# EAGLE design MetalDetector (EAGLE 7.2.0)
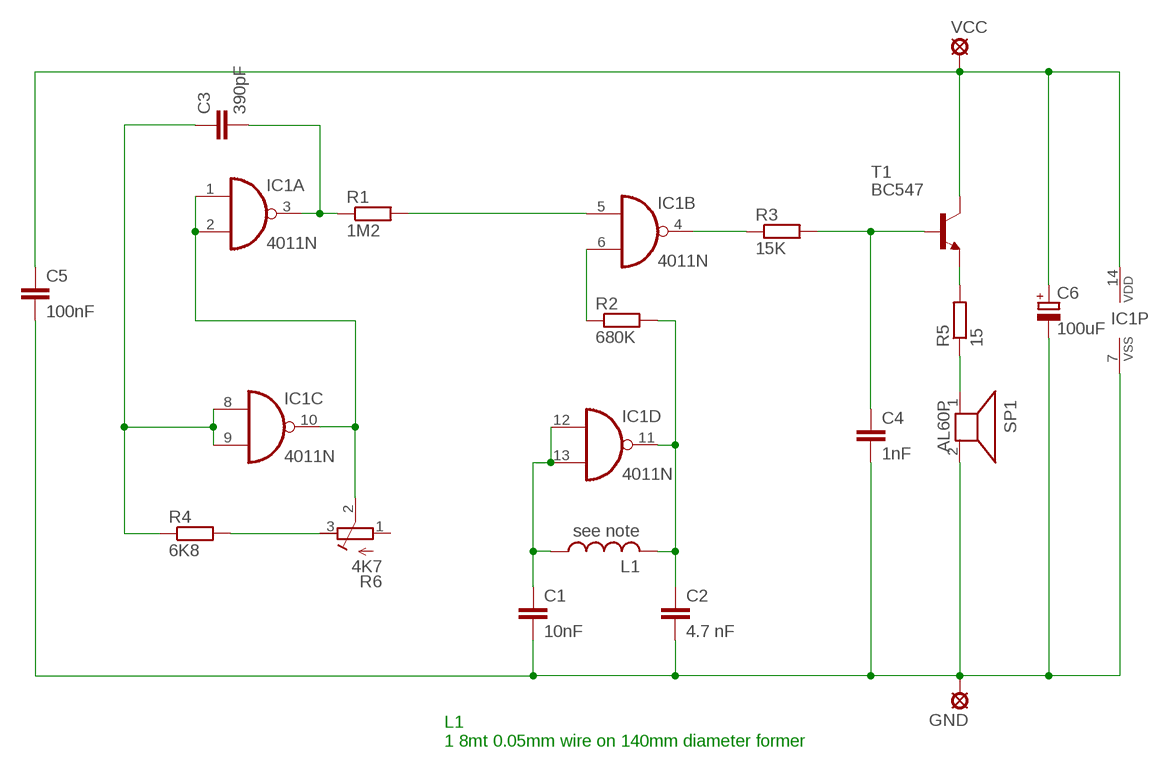
[diagram p0: schematic, sheet 1]

## Parts
C1  10nF  C-EU025-025X050  [C025-025X050]
C2  4.7 nF  C-EU025-025X050  [C025-025X050]
C3  390pF  C-EU025-025X050  [C025-025X050]
C4  1nF  C-EU025-025X050  [C025-025X050]
C5  100nF  C-EU025-025X050  [C025-025X050]
C6  100uF  CPOL-EUE5-8.5  [E5-8,5]
GND  LSP10  [LSP10]
IC1  4011N  [DIL14]
L1  see note  L-US6000-XXX-RC  [6000-XXXX-RC]
R1  1M2  R-EU_0207/12  [0207/12]
R2  680K  R-EU_0207/12  [0207/12]
R3  15K  R-EU_0207/12  [0207/12]
R4  6K8  R-EU_0207/12  [0207/12]
R5  15  R-EU_0207/12  [0207/12]
R6  4K7  R-TRIMM3339P  [RTRIM3339P]
SP1  AL60P  [AL60P]
T1  BC547  [TO92]
VCC  LSP10  [LSP10]

## Nets
N$1: IC1.1(A:I0) IC1.2(A:I1) IC1.10(C:O) R6.2(S)
N$2: C3.1 IC1.8(C:I0) IC1.9(C:I1) R4.1
N$3: C1.1 IC1.12(D:I0) IC1.13(D:I1) L1.1
N$4: C3.2 IC1.3(A:O) R1.1
N$5: IC1.5(B:I0) R1.2
N$6: R5.2 T1.1(E)
N$7: C2.1 IC1.11(D:O) L1.2 R2.2
N$8: IC1.4(B:O) R3.1
N$9: C4.1 R3.2 T1.2(B)
N$10: R5.1 SP1.1
N$12: C1.2 C2.2 C4.2 C5.2 C6.- GND.MP IC1.7(P:VSS) SP1.2
N$13: C5.1 C6.+ IC1.14(P:VDD) T1.3(C) VCC.MP
N$15: IC1.6(B:I1) R2.1
N$18: R4.2 R6.3(E)
Unconnected: R6.1(A)

## Notes on the sheet
- L1 
  1 8mt 0.05mm wire on 140mm diameter former

## Library data of the parts
C1-C5 = rcl:C-EU: CAPACITOR, European symbol
C6 = rcl:CPOL-EU: POLARIZED CAPACITOR, European symbol
GND VCC = solpad:LSP10: SOLDER PAD drill 1.0 mm, distributor Buerklin, 12H555
IC1 = 40xx:4011: Quad 2-input NAND
L1 = rcl:L-US: INDUCTOR, American symbol
R1-R5 = resistor:R-EU_: RESISTOR, European symbol
R6 = resistor:R-TRIMM: Trimm resistor
SP1 = buzzer:AL60P: SPEAKER Source: Buerklin; OC_FARNELL: unknown; OC_NEWARK: unknown
T1 = transistor:BC547: NPN TRANSISTOR

## Board
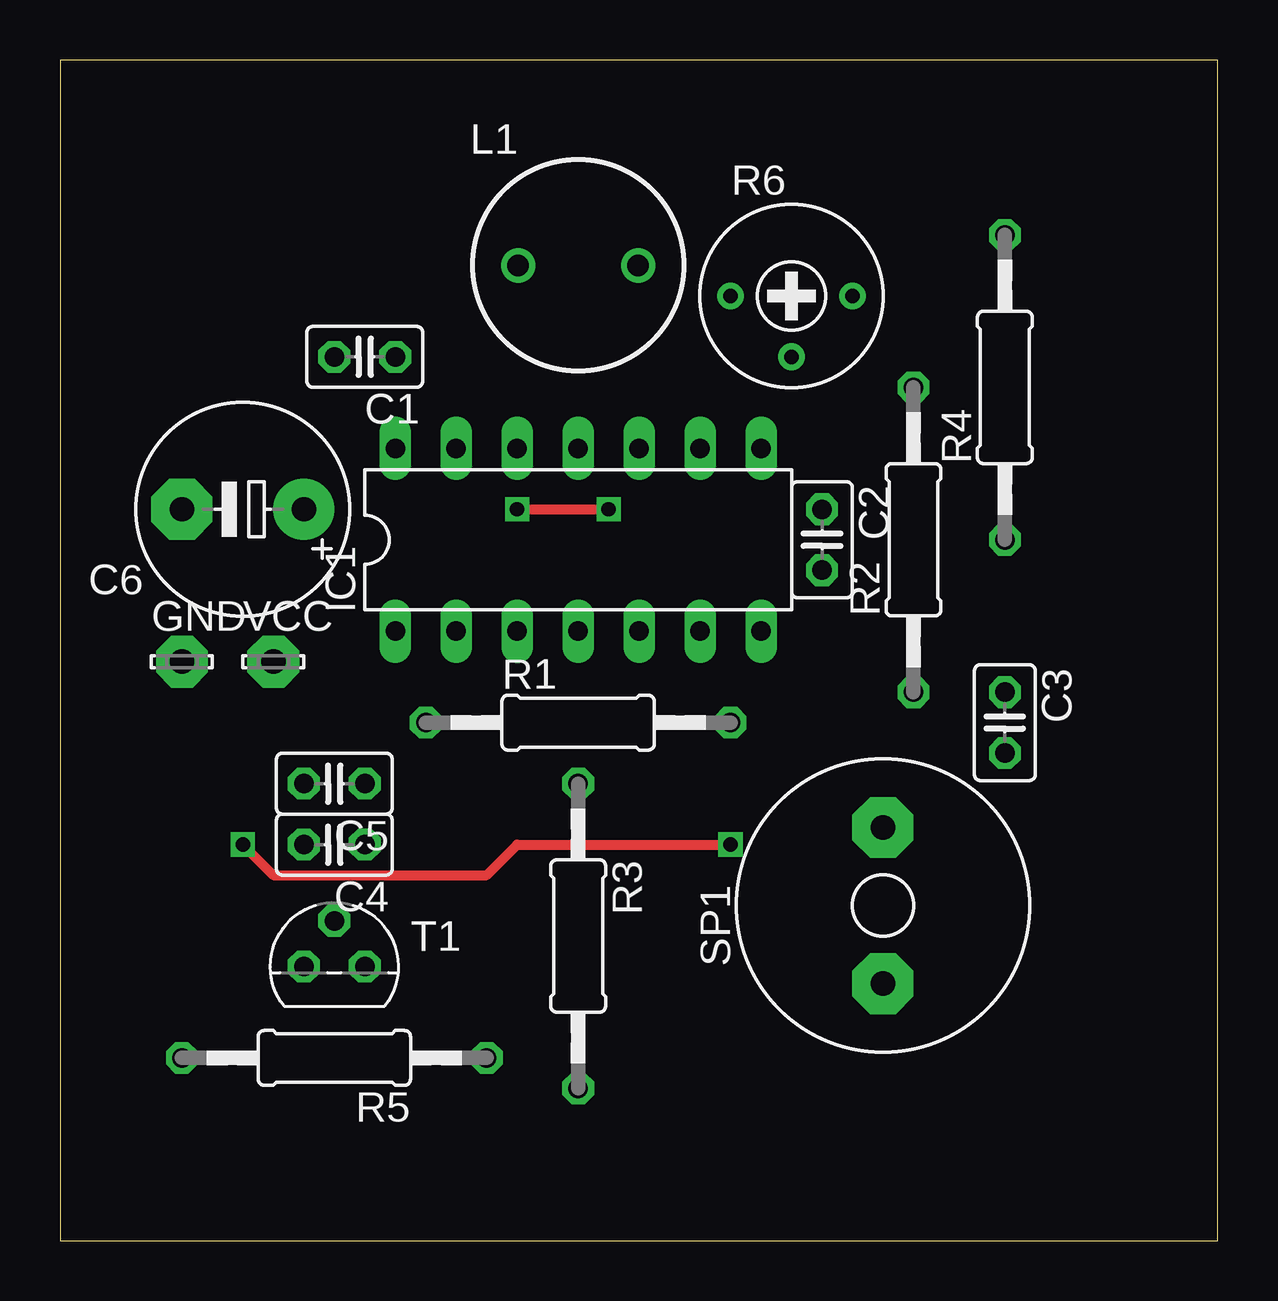
[diagram p1: board, top side]
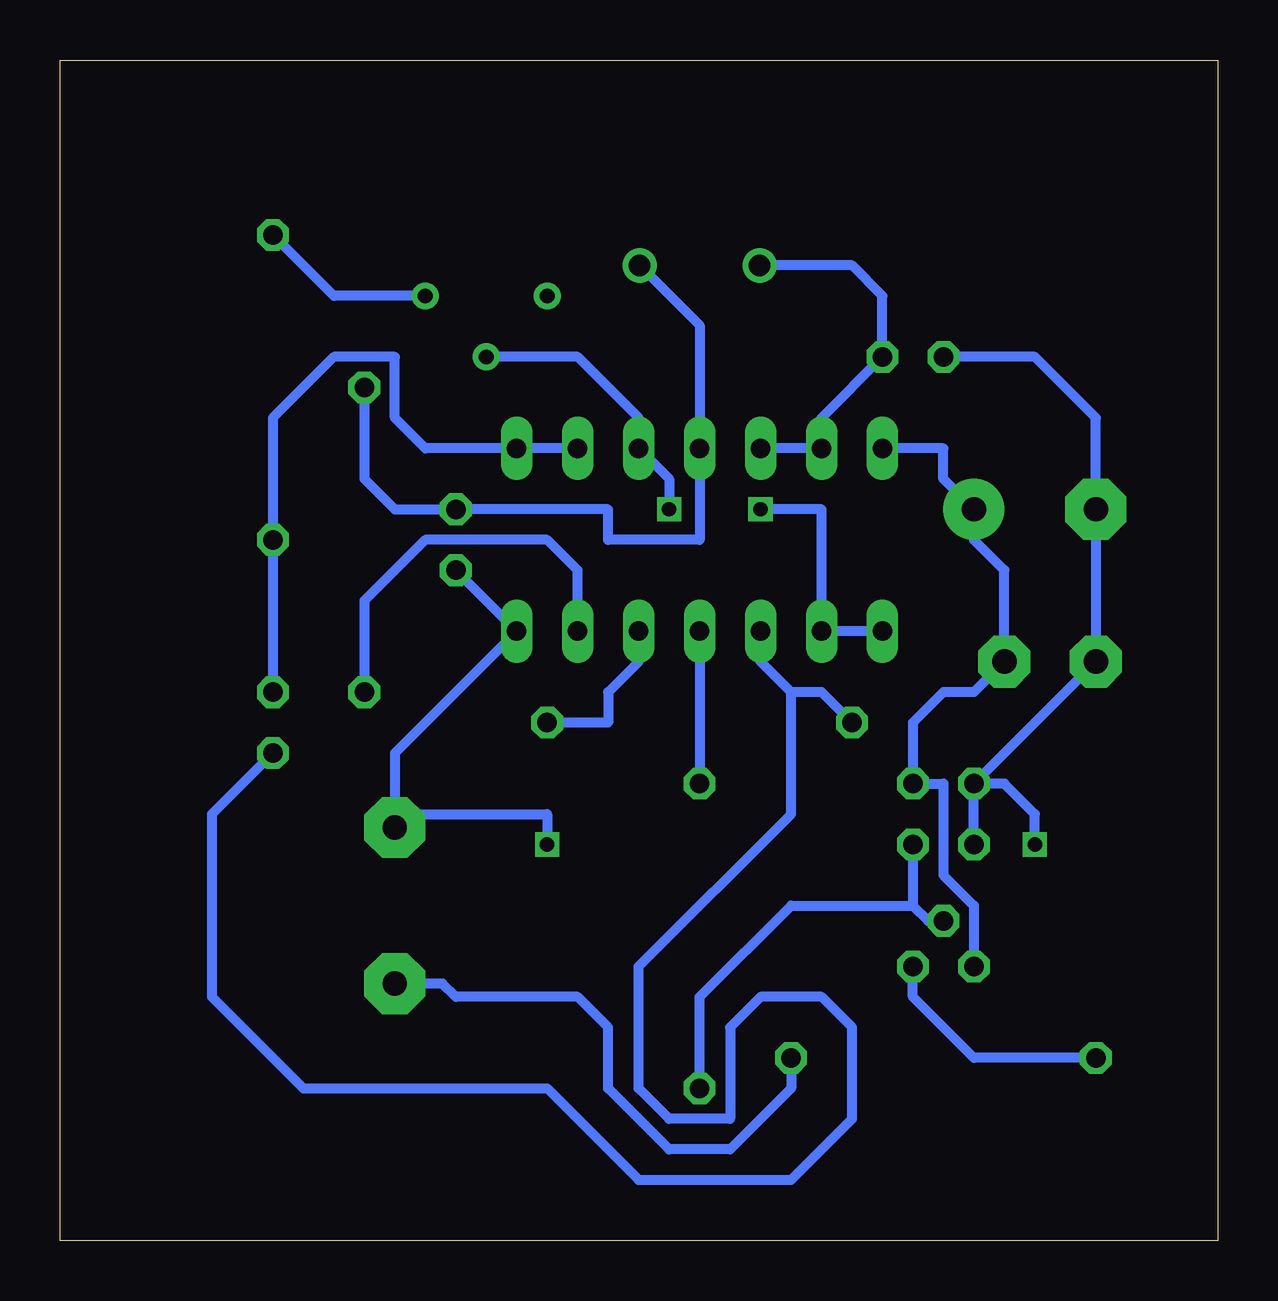
[diagram p2: board, bottom side, seen from below]

Size 48.24 x 49.2 mm. Coordinates in mm from the lower left corner, seen from the top.
Outline: 0,0 48.24,0 48.24,49.2 0,49.2 0,0
Copper layers (1*16): Top 0.035mm / dielectric 1.5mm / Bottom 0.035mm
Design rules "default": minimum track width 10mil, minimum drill 24mil, track to track 8mil, track to pad 8mil, pad to pad 8mil, via to via 8mil, smd to smd 8mil, copper to edge 40mil, drill to drill 8mil, minimum pad ring 10mil, minimum via ring 8mil, stop-mask expansion 4mil, vias tented up to drill 0mil, thermal gap 10mil

### Footprints (pad centres in the part's own frame; a part is rotated, then mirrored left to right if it is on the bottom)
C025-025X050 = drill 0.813 octagon: 1 -1.27,0; 2 1.27,0
E5-8,5 = drill 1.016 pad 2.54: + -2.54,0 | drill 1.016 pad 2.54 octagon: - 2.54,0
LSP10 = drill 1.016 pad 2.159 octagon: MP 0,0
DIL14 = drill 0.813 long: 1 -7.62,-3.81; 2 -5.08,-3.81; 3 -2.54,-3.81; 4 0,-3.81; 5 2.54,-3.81; 6 5.08,-3.81; 7 7.62,-3.81; 8 7.62,3.81; 9 5.08,3.81; 10 2.54,3.81; 11 0,3.81; 12 -2.54,3.81; 13 -5.08,3.81; 14 -7.62,3.81
6000-XXXX-RC = drill 0.9 pad 1.422: 1 -2.5,0; 2 2.5,0
0207/12 = drill 0.813 octagon: 1 -6.35,0; 2 6.35,0
RTRIM3339P = drill 0.61: 1 -2.54,0; 2 0,-2.54; 3 2.54,0
AL60P = drill 1.016 pad 2.54 octagon: 1 -3.251,0; 2 3.251,0
TO92 = drill 0.813 octagon: 1 1.27,0; 2 0,1.905; 3 -1.27,0

### Placement (x,y rotation side)
C1  12.7,36.83 180 top
C2  31.75,29.21 270 top
C3  39.37,21.59 270 top
C4  11.43,16.51 180 top
C5  11.43,19.05 180 top
C6  7.62,30.48 180 top
GND  5.08,24.13 0 top
IC1  21.59,29.21 0 top
L1  21.59,40.64 0 top
R1  21.59,21.59 0 top
R2  35.56,29.21 90 top
R3  21.59,12.7 270 top
R4  39.37,35.56 90 top
R5  11.43,7.62 180 top
R6  30.48,39.37 0 top
SP1  34.29,13.97 90 top
T1  11.43,11.43 0 top
VCC  8.89,24.13 0 top

### Tracks (layer width: path | path; a pad name or v marks a point on that pad's centre or on a via)
N$1  (via drill 0.6)
  Top 0.406: v19.05,30.48 v22.86,30.48
  Bottom 0.406: IC1.1 IC1.2 16.51,30.48 v19.05,30.48 | R6.2 26.67,36.83 24.13,34.29 IC1.10 22.86,31.75 v22.86,30.48
N$2
  Bottom 0.406: IC1.9 IC1.8 33.02,33.02 34.29,34.29 34.29,36.83 36.83,36.83 39.37,34.29 R4.1 C3.1
N$3
  Bottom 0.406: IC1.12 IC1.13 16.51,34.29 C1.1 13.97,39.37 15.24,40.64 L1.1
N$4
  Bottom 0.406: R1.1 16.51,22.86 17.78,22.86 | 17.78,22.86 19.05,24.13 IC1.3 | C3.2 41.91,17.78 41.91,10.16 38.1,6.35 27.94,6.35 24.13,2.54 17.78,2.54 15.24,5.08 15.24,8.89 16.51,10.16 19.05,10.16 20.32,8.89 20.32,5.08 22.86,5.08 24.13,6.35 24.13,11.43 17.78,17.78 17.78,22.86
N$5
  Bottom 0.406: IC1.5 24.13,24.13 25.4,22.86 25.4,21.59 R1.2
N$6
  Bottom 0.406: R5.2 10.16,7.62 12.7,10.16 T1.1
N$7
  Bottom 0.406: R2.2 35.56,31.75 34.29,30.48 C2.1 25.4,30.48 25.4,29.21 21.59,29.21 IC1.11 21.59,38.14 L1.2
N$8
  Bottom 0.406: IC1.4 R3.1
N$9
  Bottom 0.406: C4.1 12.7,13.97 | 12.7,13.97 12.06,13.34 T1.2 | R3.2 21.59,10.16 17.78,13.97 12.7,13.97
N$10
  Bottom 0.406: R5.1 17.78,6.35 20.32,3.81 22.86,3.81 25.4,6.35 25.4,8.89 26.67,10.16 31.75,10.16 32.31,10.72 SP1.1
N$12  (via drill 0.6)
  Top 0.406: v7.62,16.51 8.89,15.24 17.78,15.24 19.05,16.51 v27.94,16.51
  Bottom 0.406: v7.62,16.51 7.62,17.78 8.89,19.05 C5.2 | C2.2 IC1.7 34.29,20.32 34.29,17.78 | 34.29,17.78 SP1.2 | C1.2 7.62,36.83 5.08,34.29 C6.- GND.MP C5.2 | C4.2 C5.2 | 34.29,17.78 27.94,17.78 v27.94,16.51
N$13
  Bottom 0.406: T1.3 10.16,13.97 11.43,15.24 11.43,19.05 C5.1 12.7,21.59 11.43,22.86 10.16,22.86 VCC.MP 8.89,27.94 10.16,29.21 C6.+ 11.43,31.75 11.43,33.02 IC1.14
N$15
  Bottom 0.406: IC1.6 26.67,27.94 27.94,29.21 33.02,29.21 35.56,26.67 R2.1
N$18
  Bottom 0.406: R6.3 36.83,39.37 R4.2